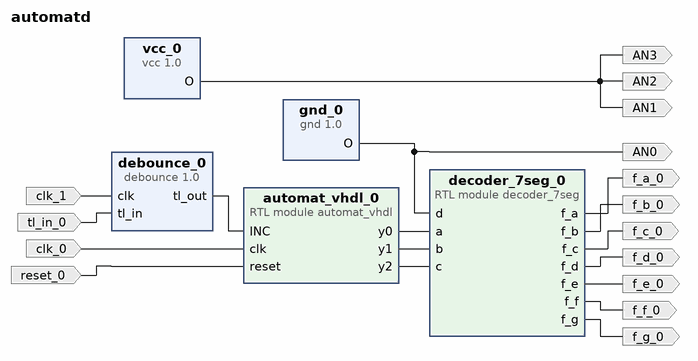
[diagram p0: block diagram of the top level]
# Vivado block design automatd, xc7a35tcpg236-1, Vivado 2018.3
create_bd_design automatd

create_bd_port -dir I -type clk clk_0
create_bd_port -dir I -type rst reset_0
create_bd_port -dir O f_a_0
create_bd_port -dir O f_b_0
create_bd_port -dir O f_c_0
create_bd_port -dir O f_d_0
create_bd_port -dir O f_e_0
create_bd_port -dir O f_f_0
create_bd_port -dir O f_g_0
create_bd_port -dir O AN0
create_bd_port -dir O AN1
create_bd_port -dir O AN2
create_bd_port -dir O AN3
create_bd_port -dir I clk_1
create_bd_port -dir I tl_in_0

create_bd_cell -type module -reference decoder_7seg decoder_7seg_0
create_bd_cell -type module -reference automat_vhdl automat_vhdl_0
create_bd_cell -type ip -vlnv FIT:user:gnd:1.0 gnd_0
create_bd_cell -type ip -vlnv FIT:user:vcc:1.0 vcc_0
create_bd_cell -type ip -vlnv FIT:user:debounce:1.0 debounce_0

# ---- connections ----

connect_bd_net [get_bd_pins automat_vhdl_0/y0] [get_bd_pins decoder_7seg_0/a]
connect_bd_net [get_bd_pins automat_vhdl_0/y1] [get_bd_pins decoder_7seg_0/b]
connect_bd_net [get_bd_pins automat_vhdl_0/y2] [get_bd_pins decoder_7seg_0/c]
connect_bd_net [get_bd_pins gnd_0/O] [get_bd_pins decoder_7seg_0/d] [get_bd_ports AN0]
connect_bd_net -net clk_0_1 [get_bd_ports clk_0] [get_bd_pins automat_vhdl_0/clk]
connect_bd_net -net reset_0_1 [get_bd_ports reset_0] [get_bd_pins automat_vhdl_0/reset]
connect_bd_net [get_bd_pins decoder_7seg_0/f_a] [get_bd_ports f_a_0]
connect_bd_net [get_bd_pins decoder_7seg_0/f_b] [get_bd_ports f_b_0]
connect_bd_net [get_bd_pins decoder_7seg_0/f_c] [get_bd_ports f_c_0]
connect_bd_net [get_bd_pins decoder_7seg_0/f_d] [get_bd_ports f_d_0]
connect_bd_net [get_bd_pins decoder_7seg_0/f_e] [get_bd_ports f_e_0]
connect_bd_net [get_bd_pins decoder_7seg_0/f_f] [get_bd_ports f_f_0]
connect_bd_net [get_bd_pins decoder_7seg_0/f_g] [get_bd_ports f_g_0]
connect_bd_net [get_bd_pins vcc_0/O] [get_bd_ports AN1] [get_bd_ports AN3] [get_bd_ports AN2]
connect_bd_net [get_bd_pins debounce_0/tl_out] [get_bd_pins automat_vhdl_0/INC]
connect_bd_net -net clk_1_1 [get_bd_ports clk_1] [get_bd_pins debounce_0/clk]
connect_bd_net -net tl_in_0_1 [get_bd_ports tl_in_0] [get_bd_pins debounce_0/tl_in]

validate_bd_design
save_bd_design
